# Altium schematic sheet LCD.SchDoc
size A; SheetNumber: 7; SheetTotal: 9
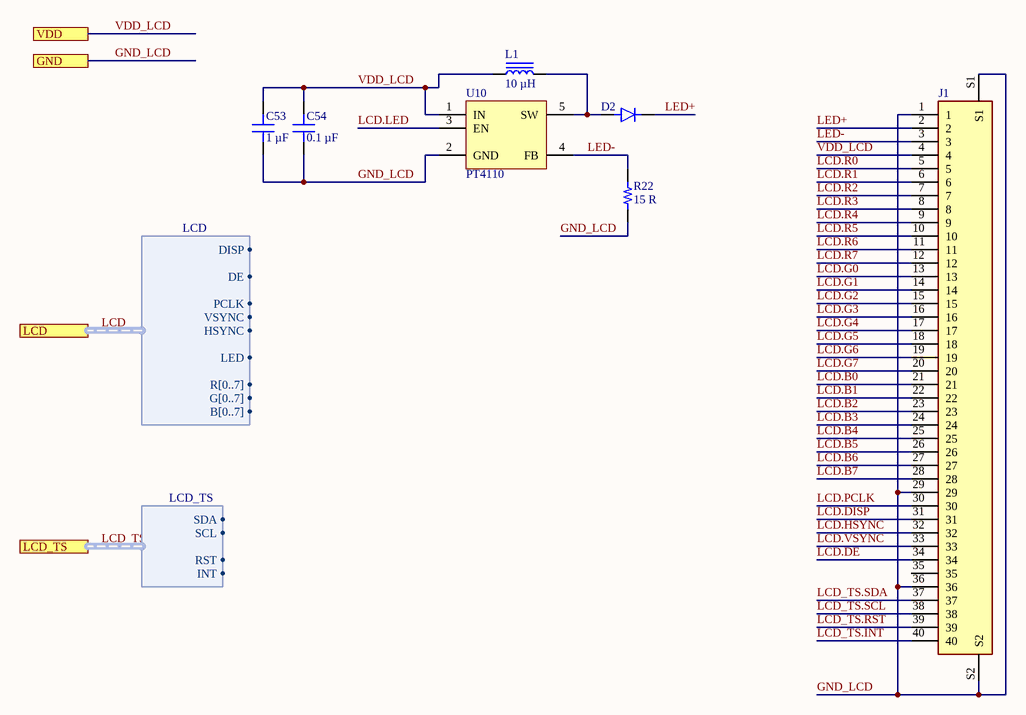
[diagram p0: LCD.SchDoc]

## Parts
C53  1 µF  [CAP 0402_1005]
C54  0.1 µF  [CAP 0402_1005]
D2  Diode  [Diode DFN1608D-2 (SOD1608)]  (value not drawn)
J1  40pin_0.5mm_ZIF  [40pin_0.5mmPitch]  (value not drawn)
L1  10 µH  [IND 0806_2016]
R22  15 R  [RES 0603_1608]
U10  PT4110  [SOT-89-5]

## Ports
GND, LCD (harness LCD), LCD_TS (harness LCD_TS), VDD

## Harnesses
LCD: PCLK, DISP, VSYNC, HSYNC, DE, LED, R[0..7], G[0..7], B[0..7]
LCD_TS: INT, RST, SCL, SDA

## Nets
GND_LCD: C53.1 C54.1 J1.1 J1.29 J1.36 J1.S1 J1.S2 R22.2 U10.2(GND) ; port GND
LCD.B0: J1.21
LCD.B1: J1.22
LCD.B2: J1.23
LCD.B3: J1.24
LCD.B4: J1.25
LCD.B5: J1.26
LCD.B6: J1.27
LCD.B7: J1.28
LCD.DE: J1.34
LCD.DISP: J1.31
LCD.G0: J1.13
LCD.G1: J1.14
LCD.G2: J1.15
LCD.G3: J1.16
LCD.G4: J1.17
LCD.G5: J1.18
LCD.G6: J1.19
LCD.G7: J1.20
LCD.HSYNC: J1.32
LCD.LED: U10.3(EN)
LCD.PCLK: J1.30
LCD.R0: J1.5
LCD.R1: J1.6
LCD.R2: J1.7
LCD.R3: J1.8
LCD.R4: J1.9
LCD.R5: J1.10
LCD.R6: J1.11
LCD.R7: J1.12
LCD.VSYNC: J1.33
LCD_TS.INT: J1.40
LCD_TS.RST: J1.39
LCD_TS.SCL: J1.38
LCD_TS.SDA: J1.37
LED+: D2.1(A) J1.2
LED-: J1.3 R22.1 U10.4(FB)
VDD_LCD: C53.2 C54.2 J1.4 L1.1 U10.1(IN) ; port VDD
NetD2_2: D2.2(BLUE(C)) L1.2 U10.5(SW)

Not connected (* = marked no-connect by the designer): J1 35

## Buses and harness runs
harness LCD = port LCD
harness LCD_TS = port LCD_TS

## Library data of the parts
C53 = C0402C104K4RACAUTO: CAP CER 0.1UF 16V X7R 0402; manufacturer: KEMET; Capacitance: 0.1 µF; Tolerance: ±10%; Part Number: C0402C104K4RACAUTO; Value: 1 µF; Applications: Automotive, Bypass, Decoupling; componentlink1description: Datasheet; componentlink1url: https://api.kemet.com/component-edge/download/specsheet/C0402C104K4RACAUTO.pdf; componentlink2description: DigiKey Link; componentlink2url: https://www.digikey.com/en/products/detail/kemet/C0402C104K4RACAUTO/3314827; Device Package: 0402 (1005 Metric); lastupdated: 8/14/2022 9:05:51 PM; Lifecycle Status: Active; Minimum Order: 1; Mounting Type: Surface Mount, MLCC; Operating Temperature: -55°C ~ 125°C; Package / Case: 0402 (1005 Metric); packaging: TapeAndReel; partid: 3024; Part Status: Active; price: 0.01; Ratings: AEC-Q200; series: SMD Auto X7R; Size / Dimension: 0.039" L x 0.020" W (1.00mm x 0.50mm); Supplier 1: DigiKey; Supplier Part Number 1: 399-6828-1-ND; Temperature Coefficient: X7R; Thickness (Max): 0.022" (0.55mm); Voltage - Rated: 16V
C54 = C0402C104K4RACAUTO: CAP CER 0.1UF 16V X7R 0402; manufacturer: KEMET; Tolerance: ±10%; Part Number: C0402C104K4RACAUTO; Value: 0.1 µF; Applications: Automotive, Bypass, Decoupling; Capacitance: 0.1 µF; componentlink1description: Datasheet; componentlink1url: https://api.kemet.com/component-edge/download/specsheet/C0402C104K4RACAUTO.pdf; componentlink2description: DigiKey Link; componentlink2url: https://www.digikey.com/en/products/detail/kemet/C0402C104K4RACAUTO/3314827; Device Package: 0402 (1005 Metric); lastupdated: 8/14/2022 9:05:51 PM; Lifecycle Status: Active; Minimum Order: 1; Mounting Type: Surface Mount, MLCC; Operating Temperature: -55°C ~ 125°C; Package / Case: 0402 (1005 Metric); packaging: TapeAndReel; partid: 3024; Part Status: Active; price: 0.01; Ratings: AEC-Q200; series: SMD Auto X7R; Size / Dimension: 0.039" L x 0.020" W (1.00mm x 0.50mm); Supplier 1: DigiKey; Supplier Part Number 1: 399-6828-1-ND; Temperature Coefficient: X7R; Thickness (Max): 0.022" (0.55mm); Voltage - Rated: 16V
D2 = Diode: DFN1608D-2 (SOD1608); Manufacturer: Cree; ComponentLink2Description: Datasheet; Temperature: -40°C to +100°C; Package: LED_3MM2X2MM8; Supplier 2: Mouser; Price: 0.203999996142; Supplier 1: Digi-Key; ComponentLink1URL: https://upverter.com/upn/revision/9d0b31f7b1982705/; Supplier Part Number 2: 941-CLV1LFKBC7673673; Supplier Part Number 1: CLV1L-FKB-CHMMQEHBB7673673-ND; ComponentLink1Description: Upverter; ComponentLink2URL: http://www.cree.com/~/media/Files/Cree/LED-Components-and-Modules/HB/Data-Sheets/CLV1L-FKB-1238.pdf; RoHS: TRUE; Mouser Part Number: 941-CLV1LFKBC7673673; Temperature Range High: +100°C; Digikey Description: DIODE LED RGB DIFFUSED 4LCC SMD; Digikey Part Number: CLV1L-FKB-CHMMQEHBB7673673-ND; Lead Free: yes; Temperature Range Low: -40°C
J1 = 40pin_0.5mm_ZIF: 40 Position FFC, FPC Connector Contacts, Top 0.020 _0.50mm_ Surface Mount, Right Angle; MP: FH12A-40S-0.5SH_55_; MF: Hirose; Price: None; SnapEDA_Link: https://www.snapeda.com/parts/FH12A-40S-0.5SH%2855%29/Hirose%20Electric%20Co%20Ltd/view-part/447132/?ref=snap; Package: None; Availability: Unavailable; Value: *
L1 = TYA201610100M-10: FIXED IND 10UH 600MA 875MOHM SMD; Manufacturer: Laird-Signal Integrity Products; DC Resistance (DCR): 875mOhm Max; Inductance Frequency - Test: 1 MHz; Material - Core: Metal; Shielding: Shielded; Tolerance: ±20%; Type: Drum Core, Wirewound; Part Number: TYA201610100M-10; ComponentLink1Description: Datasheet; ComponentLink1URL: https://www.laird.com/sites/default/files/2020-05/TYA201610%20series%20%28Rev%20A%29.pdf; ComponentLink2Description: DigiKey Link; ComponentLink2URL: https://www.digikey.com/en/products/detail/laird-signal-integrity-products/TYA201610100M-10/12664143; Current Rating (Amps): 600 mA; Device Package: 0806 (2016 Metric); Height - Seated (Max): 0.045" (1.15mm); Inductance: 10 µH; LastUpdated: 9/19/2022 1:59:27 PM; Lifecycle Status: Active; Minimum Order: 1; Mounting Type: Surface Mount; Operating Temperature: -40°C ~ 125°C; Package / Case: 0806 (2016 Metric); Packaging: TapeAndReel; PartId: 5377; Part Status: Active; Price: 0.12; Ratings: AEC-Q200; Series: TYA201610; Size / Dimension: 0.079" L x 0.063" W (2.00mm x 1.60mm); Supplier 1: DigiKey; Supplier Part Number 1: 240-TYA201610100M-10CT-ND; Supplier Device Package: 0806; Value: 10 µH
R22 = RNCS0603BKE10K0: RES 10K OHM 0.1% 1/16W 0603; Manufacturer: Stackpole Electronics Inc; Power (Watts): 0.063W, 1/16W; Resistance: 10 kOhms; Temperature Coefficient: ±25ppm/°C; Part Number: RNCS0603BKE10K0; Value: 15 R; ComponentLink1Description: Datasheet; ComponentLink1URL: https://www.seielect.com/catalog/sei-rncs_rnch.pdf; ComponentLink2Description: DigiKey Link; ComponentLink2URL: https://www.digikey.com/en/products/detail/stackpole-electronics-inc/RNCS0603BKE10K0/1708836; Composition: Thin Film; Device Package: 0603 (1608 Metric); Features: Anti-Corrosive, Automotive AEC-Q200, Moisture Resistant; Height - Seated (Max): 0.022" (0.55mm); LastUpdated: 9/19/2022 1:22:34 PM; Lifecycle Status: Active; Minimum Order: 1; Number of Terminations: 2; Operating Temperature: -55°C ~ 155°C; Package / Case: 0603 (1608 Metric); Packaging: TapeAndReel; PartId: 4838; Part Status: Active; Price: 0.07; Ratings: AEC-Q200; Series: RNCS; Size / Dimension: 0.061" L x 0.031" W (1.55mm x 0.80mm); Supplier 1: DigiKey; Supplier Part Number 1: RNCS0603BKE10K0CT-ND; Supplier Device Package: 0603; Tolerance: ±0.1%
U10 = PT4110: LED Backlight Driver